# EasyEDA Pro project Sheet_1_2024-04-09.epro

# Schematic FT-LINK-v2
Create Date: 2024-02-24; Project Name: FT-LINK; Schematic Name: FT-LINK-v2; Update Date: 2024-02-29; Company: UC Berkeley; Version: V2.0.0
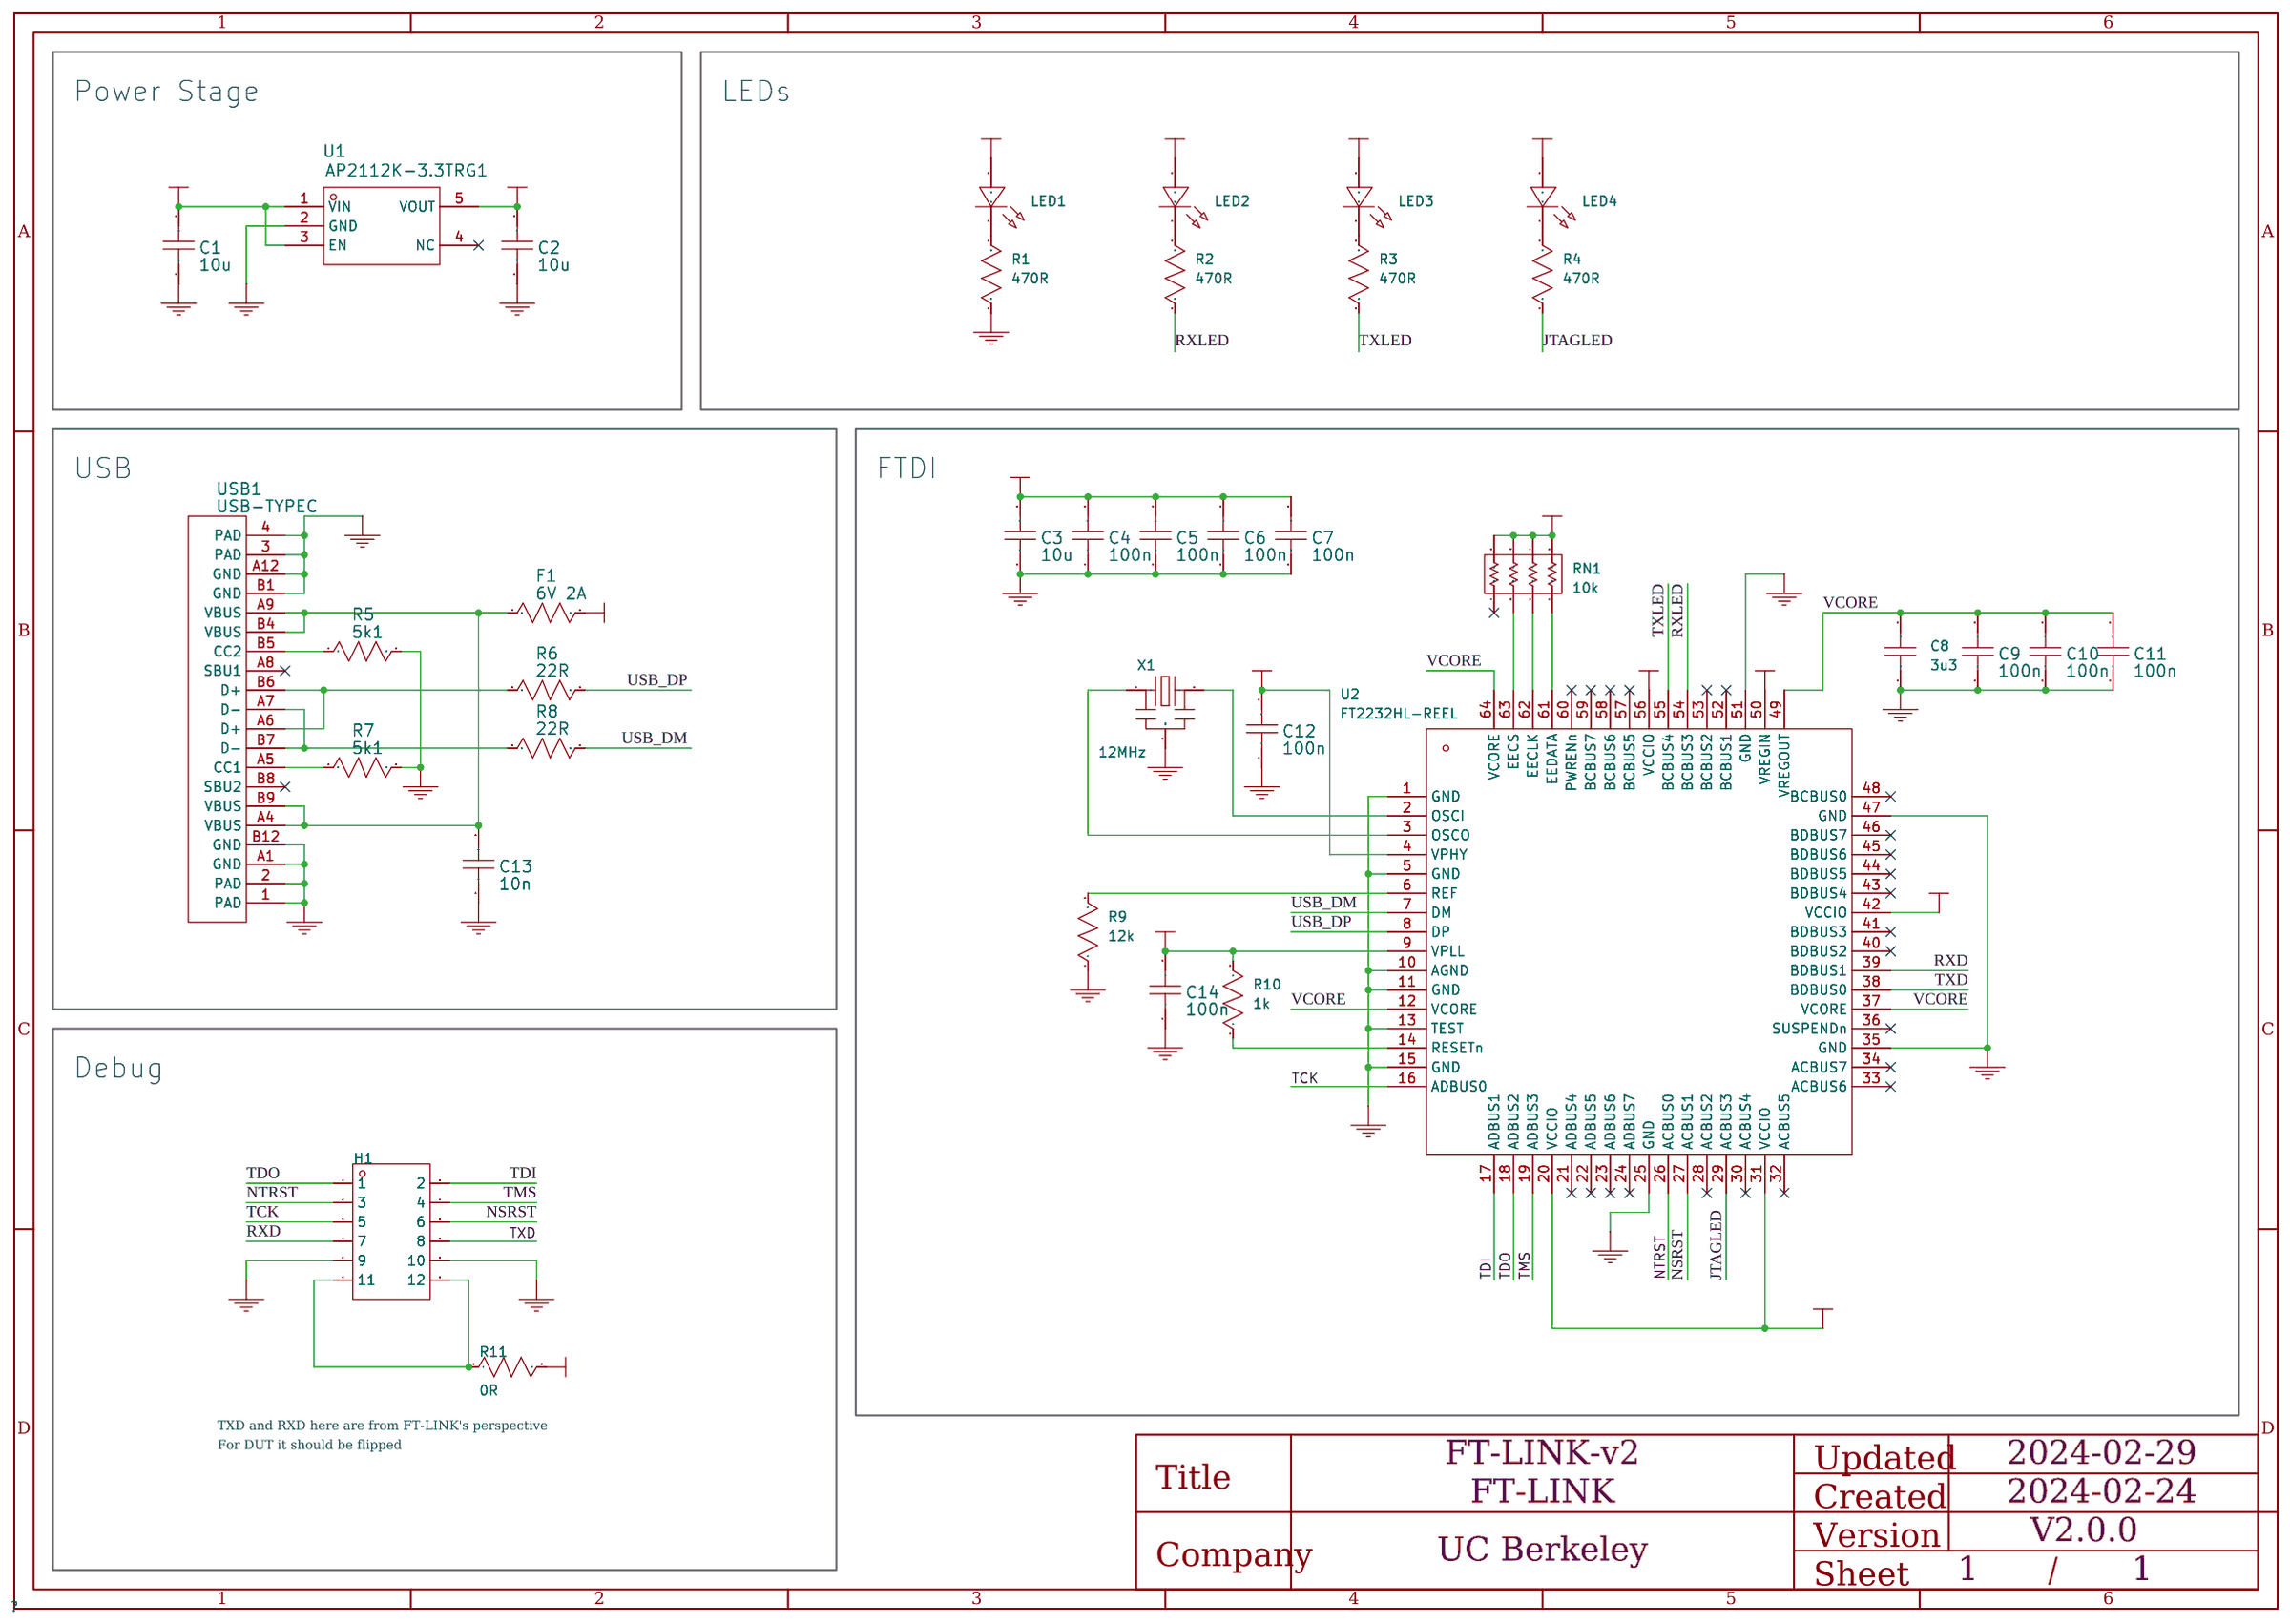
[diagram p0: schematic sheet]

## Parts
C1  10u  [CAPA-0603]
C2  10u  [CAPA-0603]
C3  10u  [CAPA-0603]
C4  100n  [CAPA-0402]
C5  100n  [CAPA-0402]
C6  100n  [CAPA-0402]
C7  100n  [CAPA-0402]
C8  3u3  [CAPA-0603]
C9  100n  [CAPA-0402]
C10  100n  [CAPA-0402]
C11  100n  [CAPA-0402]
C12  100n  [CAPA-0402]
C13  10n  [CAPA-0402]
C14  100n  [CAPA-0402]
F1  6V 2A  [R0805]
H1  -  [CONN-TH_A2541WR-2X6P]
LED1  -  [LED-0603]
LED2  -  [LED-0603]
LED3  -  [LED-0603]
LED4  -  [LED-0603]
R1  470R  [RES-0402]
R2  470R  [RES-0402]
R3  470R  [RES-0402]
R4  470R  [RES-0402]
R5  5k1  [RES-0402]
R6  22R  [RES-0402]
R7  5k1  [RES-0402]
R8  22R  [RES-0402]
R9  12k  [RES-0402]
R10  1k  [RES-0402]
R11  0R  [RES-0402-TIE]  (no BOM)
RN1  10k  [RES-ARRAY-SMD_0402-8P-L2.0-W1.0-BL]
U1  AP2112K-3.3TRG1  [SOT-25-5_L3.0-W1.8-P0.95-LS3.0-BR]
U2  FT2232HL-REEL  [LQFP-64_L10.0-W10.0-P0.50-LS12.0-TL]
USB1  USB-TYPEC  [USB-C-SMD_KH-TYPE-C-16P]
X1  12MHz  [OSC-SMD_3P-L3.2-W1.3-P1.2-L]

## Library data of the parts
C1-C3 = CL10A106KP8NNNC: Supplier Part: C19702; Supplier: LCSC; Manufacturer: SAMSUNG; link: https://atta.szlcsc.com/upload/public/pdf/source/20160103/1457707703378.pdf
C4-C7 C9-C12 C14 = CL05B104KB54PNC: Supplier Part: C307331; Supplier: LCSC; Manufacturer: SAMSUNG; link: https://atta.szlcsc.com//upload/public/pdf/source/20160103/1457707735223.pdf
C8 = CAPA-0603_3u3_25V: 3.3uF ±10% 25V X5R; Supplier Part: C342962; Supplier: LCSC; Manufacturer Part: C1608X5R1E335KT000E; Manufacturer: TDK; link: https://atta.szlcsc.com/upload/public/pdf/source/20170325/1490427913016.pdf; JLCPCB Part Class: 基础库
C13 = CL05B103KB5NNNC: Supplier Part: C15195; Supplier: LCSC; Manufacturer: SAMSUNG; link: https://atta.szlcsc.com//upload/public/pdf/source/20160103/1457707735223.pdf
F1 = SL0805200: Supplier Part: C70158; Supplier: LCSC; Manufacturer: TECHFUSE
H1 = A2541WR-2X6P: Supplier: LCSC; Supplier Part: C239337; Manufacturer: CJT 长江连接器; Manufacturer Part: A2541WR-2x6P; link: https://item.szlcsc.com/238441.html?ref=editor&amp;logined=true; JLCPCB Part Class: Extended Part
LED1 = LED-0603_R: 红灯 632nm; Manufacturer: EVERLIGHT 台湾亿光; Manufacturer Part: 19-217/R6C-AL1M2VY/3T; Supplier Part: C72044; Supplier: LCSC; link: https://atta.szlcsc.com//upload/public/pdf/source/20160507/1462613613821.pdf
LED2 LED3 = LED-0603_W: 白灯 高亮; Manufacturer: KENTO; Manufacturer Part: LED White; Supplier Part: C2290; Supplier: LCSC; link: https://atta.szlcsc.com//upload/public/pdf/source/20160507/1462613613821.pdf
LED4 = LED-0603_B: 蓝灯 高亮; Manufacturer: KENTO; Manufacturer Part: XL-0603QBC; Supplier Part: C2288; Supplier: LCSC; link: https://atta.szlcsc.com//upload/public/pdf/source/20150713/1457707325118.pdf
R1-R4 = RES-0402_470R: 厚膜电阻 470Ω ±1% 62.5mW; Supplier Part: C25117; Supplier: LCSC; Manufacturer Part: 0402WGF4700TCE; Manufacturer: UniOhm 台湾厚声; link: https://atta.szlcsc.com//upload/public/pdf/source/20200306/C422600_1E6D84923E4A46A82E41ADD87F860B5C.pdf; JLCPCB Part Class: 基础库
R5 R7 = 0402WGF5101TCE: Supplier Part: C25905; Supplier: LCSC; Manufacturer: UniOhm 台湾厚声; link: https://atta.szlcsc.com//upload/public/pdf/source/20200306/C422600_1E6D84923E4A46A82E41ADD87F860B5C.pdf
R6 R8 = 0402WGF220JTCE: Supplier Part: C25092; Supplier: LCSC; Manufacturer: UniOhm 台湾厚声; link: https://atta.szlcsc.com//upload/public/pdf/source/20200306/C422600_1E6D84923E4A46A82E41ADD87F860B5C.pdf
R9 = RES-0402_12k: 厚膜电阻 12kΩ ±1% 62.5mW; Supplier Part: C25752; Supplier: LCSC; Manufacturer Part: 0402WGF1202TCE; Manufacturer: UniOhm 台湾厚声; link: https://atta.szlcsc.com//upload/public/pdf/source/20200306/C422600_1E6D84923E4A46A82E41ADD87F860B5C.pdf; JLCPCB Part Class: 基础库
R10 = RES-0402_1k: 厚膜电阻 1kΩ ±1% 62.5mW; Supplier Part: C11702; Supplier: LCSC; Manufacturer Part: 0402WGF1001TCE; Manufacturer: UniOhm 台湾厚声; link: https://atta.szlcsc.com//upload/public/pdf/source/20200306/C422600_1E6D84923E4A46A82E41ADD87F860B5C.pdf; JLCPCB Part Class: 基础库
R11 = RES-0402_TIE: JLCPCB Part Class: 基础库
RN1 = RES-0402x4_10k: 10kΩ ±1% 0402x4; LCSC Part Name: 10kΩ ±1% 0402x4; Supplier Part: C136853; Manufacturer: YAGEO 国巨; Manufacturer Part: YC124-FR-0710KL; Supplier Footprint: 0402x4; JLCPCB Part Class: 扩展库; Datasheet: https://atta.szlcsc.com/upload/public/pdf/source/20180730/C256814_200CCA6CC84D78D7E49AE6680727F338.pdf; Supplier: LCSC; Number of Resistors: 4; Tolerance: ±1%; Power(Watts): 62.5mW; Temperature Coefficient: ±200ppm/℃; Number of Pins: 8; NO_CONNECT: yes
U1 = AP2112K-3.3TRG1: Supplier: LCSC; Manufacturer: DIODES; Supplier Part: C51118; JLCPCB Part Class: Extended Part; link: https://www.diodes.com/assets/Datasheets/AP2112.pdf
U2 = FT2232HL: 应用功能:USB转UART；USB转FIFO;接口协议:UART;; LCSC Part Name: USB到串行/FIFO; Supplier Part: C27882; Manufacturer: FTDI; Supplier Footprint: LQFP-64(10x10); JLCPCB Part Class: 扩展库; Datasheet: https://atta.szlcsc.com/upload/public/pdf/source/20140319/1457707024994.pdf; Supplier: LCSC; Applications Function: USB转UART；USB转FIFO; Protocol: UART; Supply Voltage: 3V~3.6V; Operating Temperature: -40℃~+85℃
USB1 = KH-TYPE-C-16P: Manufacturer: Shenzhen Kinghelm Elec; Supplier: LCSC; Supplier Part: C709357; link: https://atta.szlcsc.com/upload/public/pdf/source/20211022/DACD6552F639E9483017DE6DC0E61150.pdf
X1 = CSTNE12M0GH5C000R0: 频率:12MHz;内置负载电容:33pF;谐振阻抗:30Ω;; LCSC Part Name: 12MHz ±0.07% 内置负载电容:33pF; Supplier Part: C2659460; Manufacturer: muRata 村田; Supplier Footprint: SMD3213-3P; JLCPCB Part Class: 扩展库; Datasheet: https://atta.szlcsc.com/upload/public/pdf/source/20211007/C2659460_6C3FEB8F7D5B458F9C6CAE4C602F43D9.pdf; Supplier: LCSC; Built-in Load Capacitance: 33pF; Resonant Impedance: 30Ω; Operating Temperature: -40℃~+125℃

## Nets
3V3: C2.2 C3.2 C4.2 C5.2 C6.2 C7.2 C12.2 C14.2 LED1.2 LED2.2 LED3.2 LED4.2 R10.2 R11.2 RN1.5 RN1.6 RN1.7 RN1.8 U1.5(VOUT) U2.4(VPHY) U2.9(VPLL) U2.20(VCCIO) U2.31(VCCIO) U2.42(VCCIO) U2.50(VREGIN) U2.56(VCCIO)
5V: C1.2 F1.2 U1.1(VIN) U1.3(EN)
GND: C1.1 C2.1 C3.1 C4.1 C5.1 C6.1 C7.1 C8.2 C9.1 C10.1 C11.1 C12.1 C13.1 C14.1 H1.9 H1.10 R1.1 R5.2 R7.2 R9.1 U1.2(GND) U2.1(GND) U2.5(GND) U2.10(AGND) U2.11(GND) U2.13(TEST) U2.15(GND) U2.25(GND) U2.35(GND) U2.47(GND) U2.51(GND) USB1.1(PAD) USB1.2(PAD) USB1.3(PAD) USB1.4(PAD) USB1.A1(GND) USB1.A12(GND) USB1.B1(GND) USB1.B12(GND) X1.2(GND)
JTAGLED: R4.1 U2.29(ACBUS3)
NSRST: H1.6 U2.27(ACBUS1)
NTRST: H1.3 U2.26(ACBUS0)
RXD: H1.7 U2.39(BDBUS1)
RXLED: R2.1 U2.54(BCBUS3)
TCK: H1.5 U2.16(ADBUS0)
TDI: H1.2 U2.17(ADBUS1)
TDO: H1.1 U2.18(ADBUS2)
TMS: H1.4 U2.19(ADBUS3)
TXD: H1.8 U2.38(BDBUS0)
TXLED: R3.1 U2.55(BCBUS4)
USB_DM: R8.2 U2.7(DM)
USB_DP: R6.2 U2.8(DP)
VCORE: C8.1 C9.2 C10.2 C11.2 U2.12(VCORE) U2.37(VCORE) U2.49(VREGOUT) U2.64(VCORE)
Net-(C13-2): C13.2 F1.1 USB1.A4(VBUS) USB1.A9(VBUS) USB1.B4(VBUS) USB1.B9(VBUS)
Net-(H1-11): H1.11 H1.12 R11.1
Net-(LED1-1): LED1.1 R1.2
Net-(LED2-1): LED2.1 R2.2
Net-(LED3-1): LED3.1 R3.2
Net-(LED4-1): LED4.1 R4.2
Net-(R5-1): R5.1 USB1.B5(CC2)
Net-(R6-1): R6.1 USB1.A6(D+) USB1.B6(D+)
Net-(R7-1): R7.1 USB1.A5(CC1)
Net-(R8-1): R8.1 USB1.A7(D-) USB1.B7(D-)
Net-(R9-2): R9.2 U2.6(REF)
Net-(R10-1): R10.1 U2.14(RESETn)
Net-(RN1-1): RN1.1 U2.61(EEDATA)
Net-(RN1-2): RN1.2 U2.62(EECLK)
Net-(RN1-3): RN1.3 U2.63(EECS)
Net-(U2-2): U2.2(OSCI) X1.3(OUT)
Net-(U2-3): U2.3(OSCO) X1.1(IN)

Not connected (* = marked no-connect by the designer): RN1 4*; U1 4(NC)*; U2 21(ADBUS4)* 22(ADBUS5)* 23(ADBUS6)* 24(ADBUS7)* 28(ACBUS2)* 30(ACBUS4)* 32(ACBUS5)* 33(ACBUS6)* 34(ACBUS7)* 36(SUSPENDn)* 40(BDBUS2)* 41(BDBUS3)* 43(BDBUS4)* 44(BDBUS5)* 45(BDBUS6)* 46(BDBUS7)* 48(BCBUS0)* 52(BCBUS1)* 53(BCBUS2)* 57(BCBUS5)* 58(BCBUS6)* 59(BCBUS7)* 60(PWRENn)*; USB1 A8(SBU1)* B8(SBU2)*

## Notes on the sheet
- Power Stage
- LEDs
- USB
- FTDI
- Debug
- TXD and RXD here are from FT-LINK's perspective
- For DUT it should be flipped
